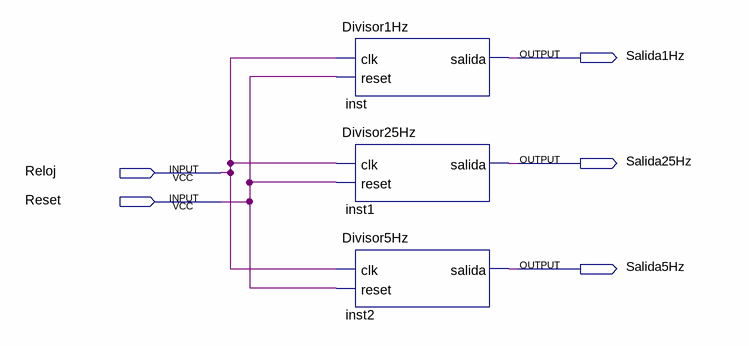
[diagram p0: schematic sheet]
// Quartus schematic Practica2.bdf as structural Verilog: 3 symbols, 5 pins
module Practica2 (
  input  Reloj,
  input  Reset,
  output Salida1Hz,
  output Salida25Hz,
  output Salida5Hz
);

  Divisor1Hz inst (.clk(Reloj), .reset(Reset), .salida(Salida1Hz));
  Divisor25Hz inst1 (.clk(Reloj), .reset(Reset), .salida(Salida25Hz));
  Divisor5Hz inst2 (.clk(Reloj), .reset(Reset), .salida(Salida5Hz));
endmodule
